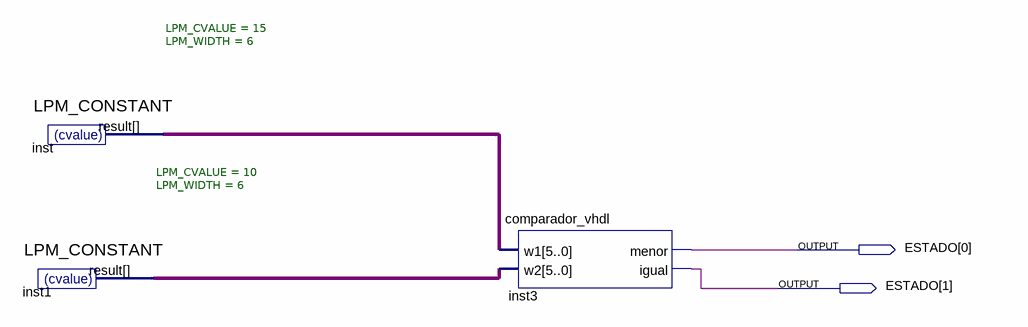
[diagram p0: schematic sheet]
// Quartus schematic ADC.bdf as structural Verilog: 3 symbols, 2 pins
module ADC (
  output [1:0] ESTADO
);

  wire [5:0] inst1_result, inst_result;

  LPM_CONSTANT #(.LPM_CVALUE(15), .LPM_WIDTH(6)) inst (.result(inst_result));
  LPM_CONSTANT #(.LPM_CVALUE(10), .LPM_WIDTH(6)) inst1 (.result(inst1_result));
  comparador_vhdl inst3 (.w1(inst_result), .w2(inst1_result), .menor(ESTADO[0]), .igual(ESTADO[1]));
endmodule
